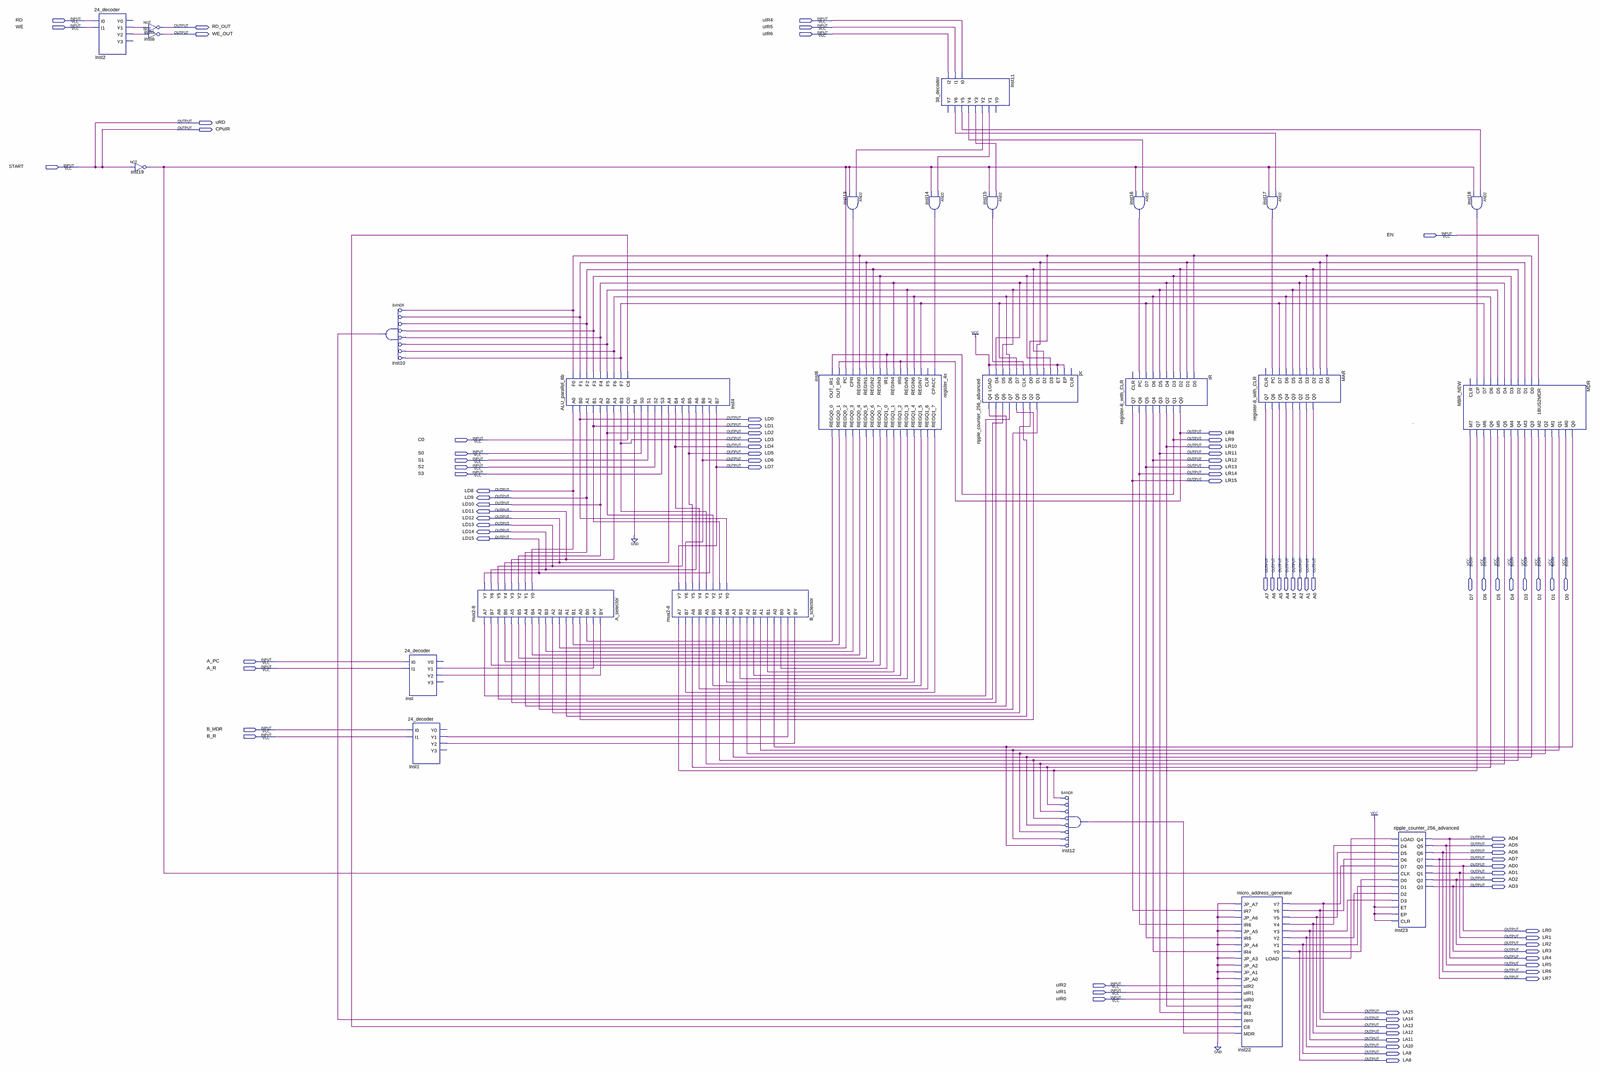
[diagram p0: schematic sheet, whole]
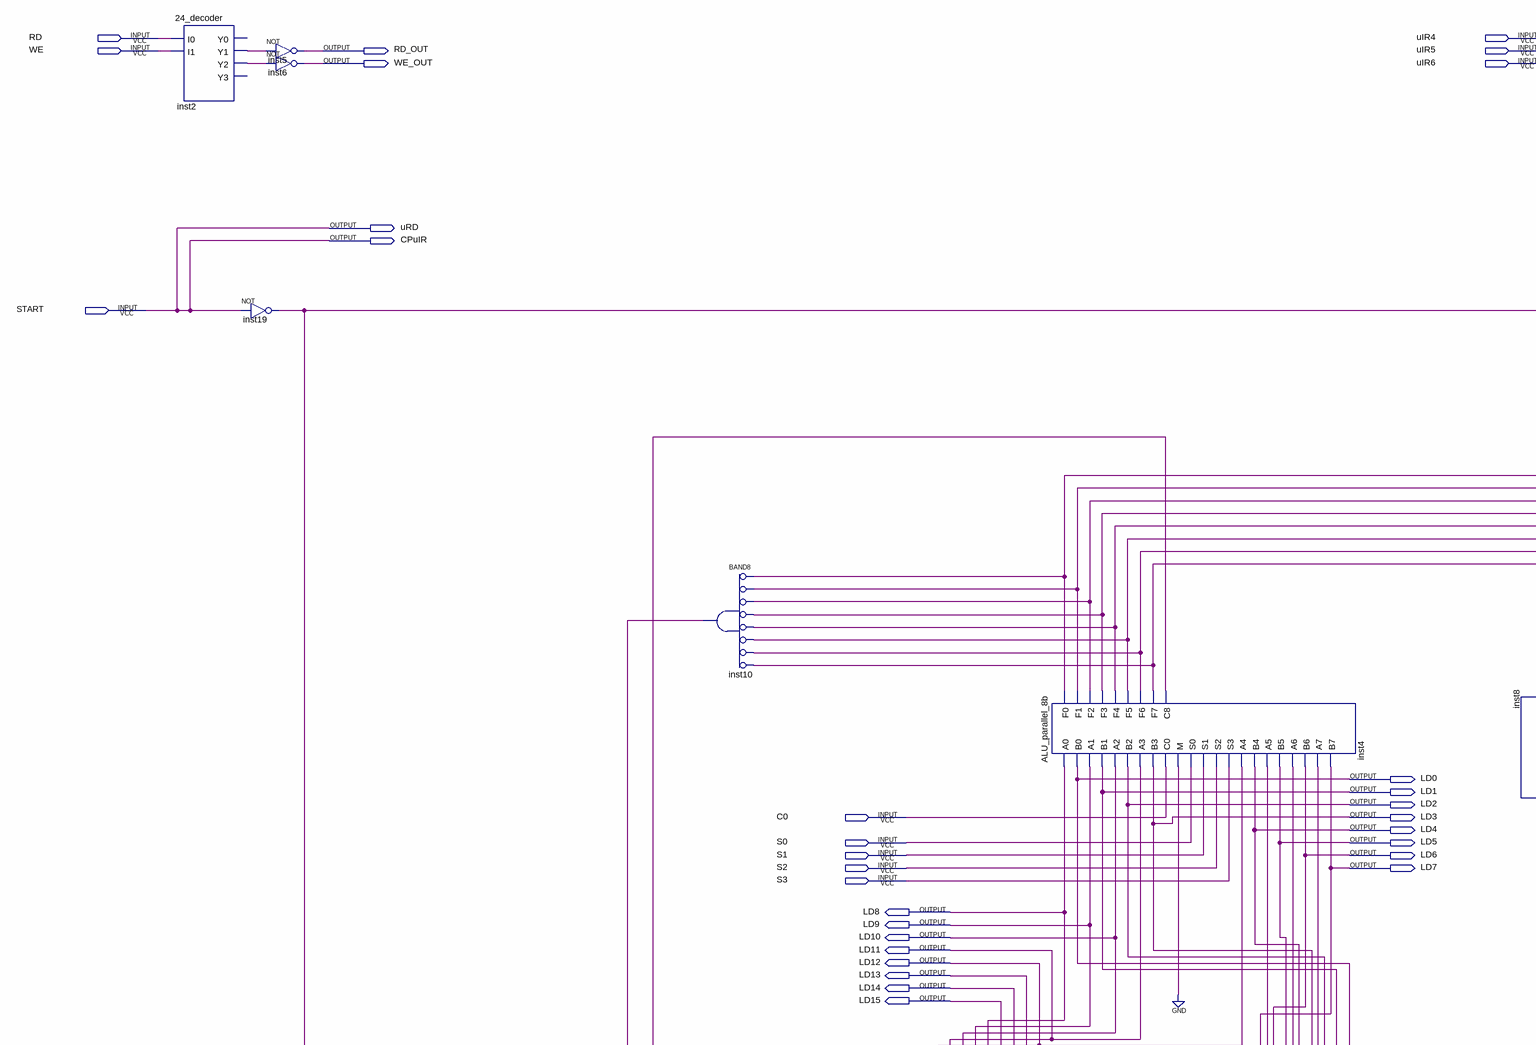
[diagram p1: schematic sheet, upper left part]
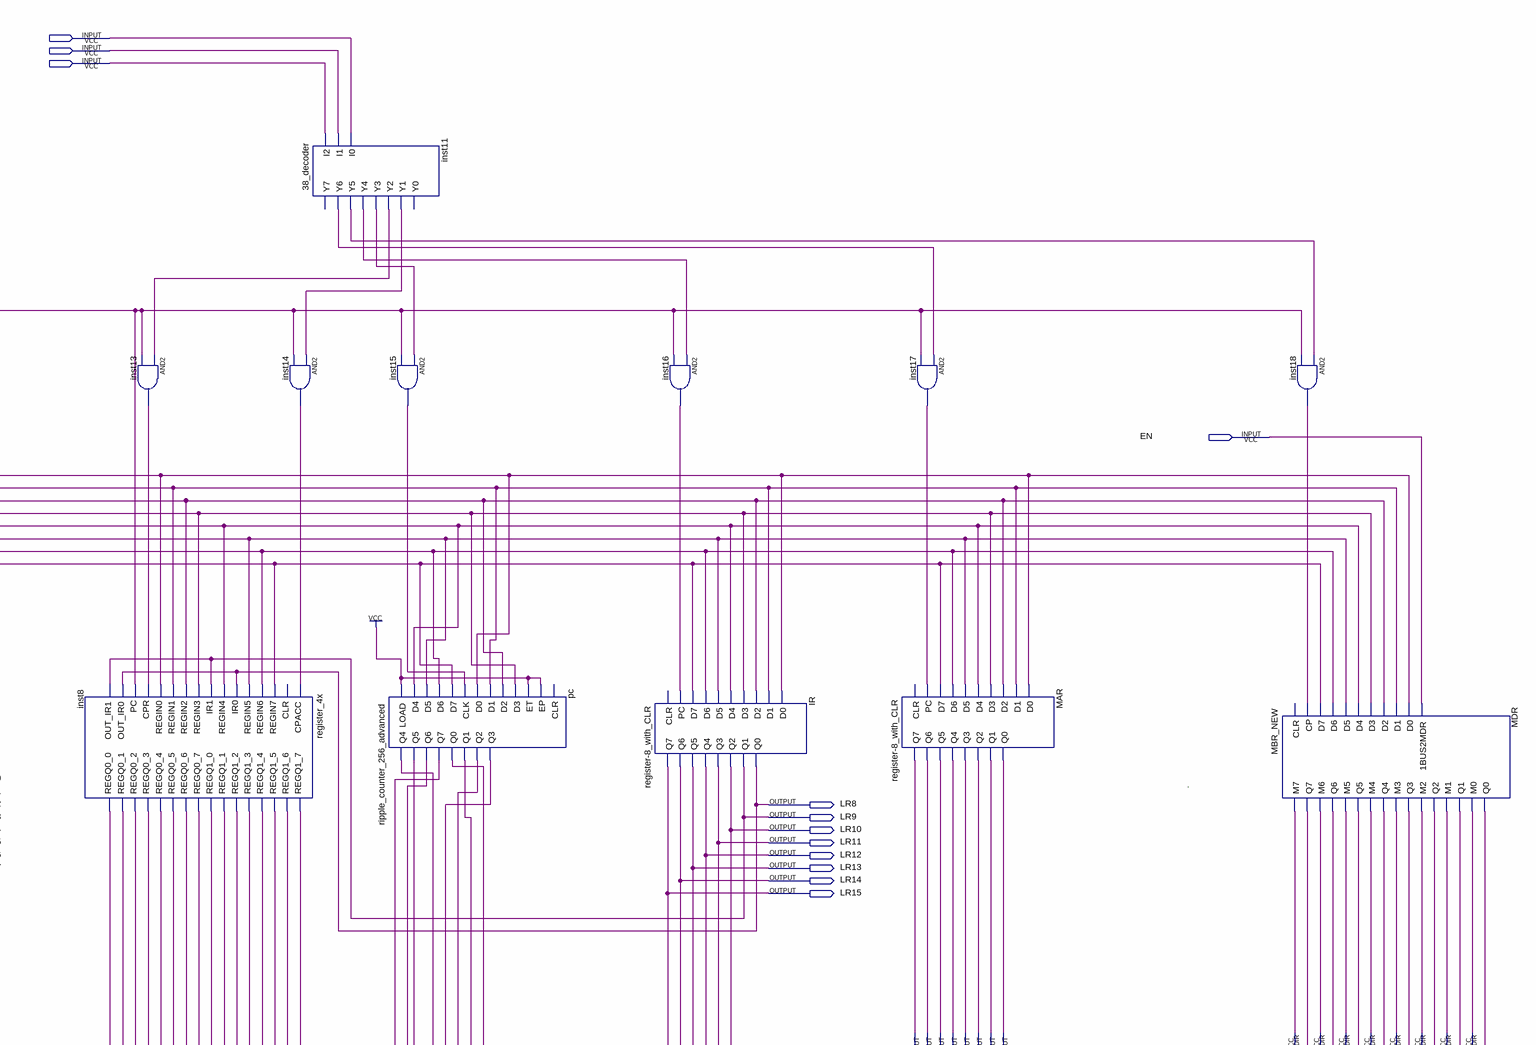
[diagram p2: schematic sheet, upper right part]
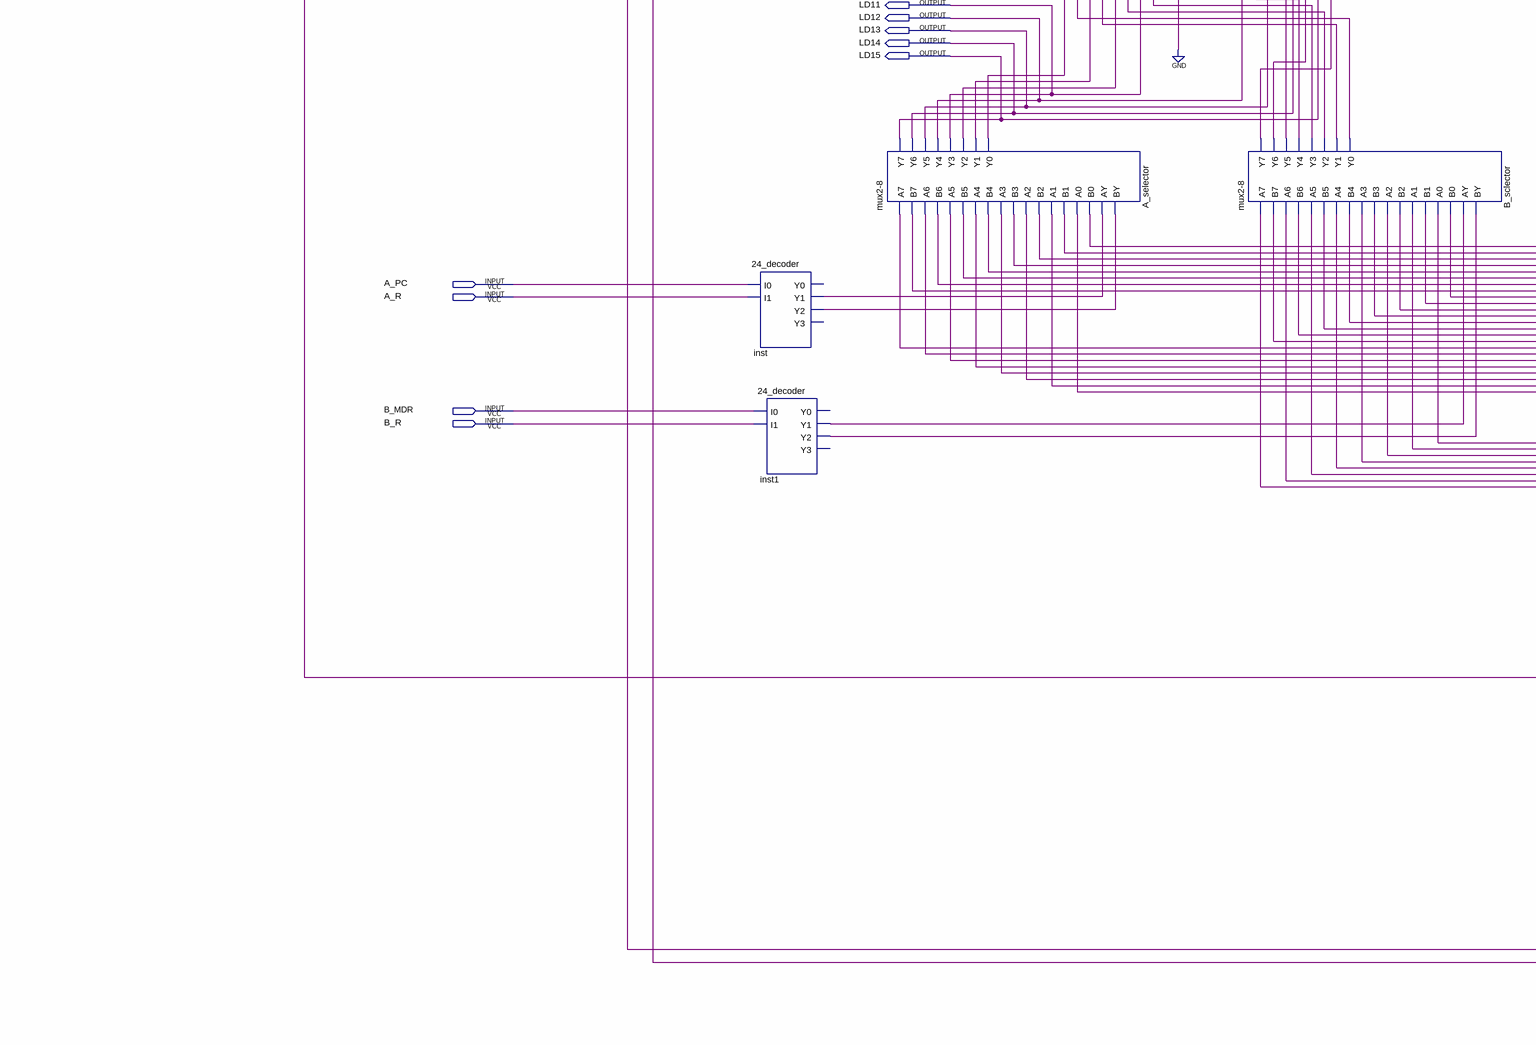
[diagram p3: schematic sheet, lower left part]
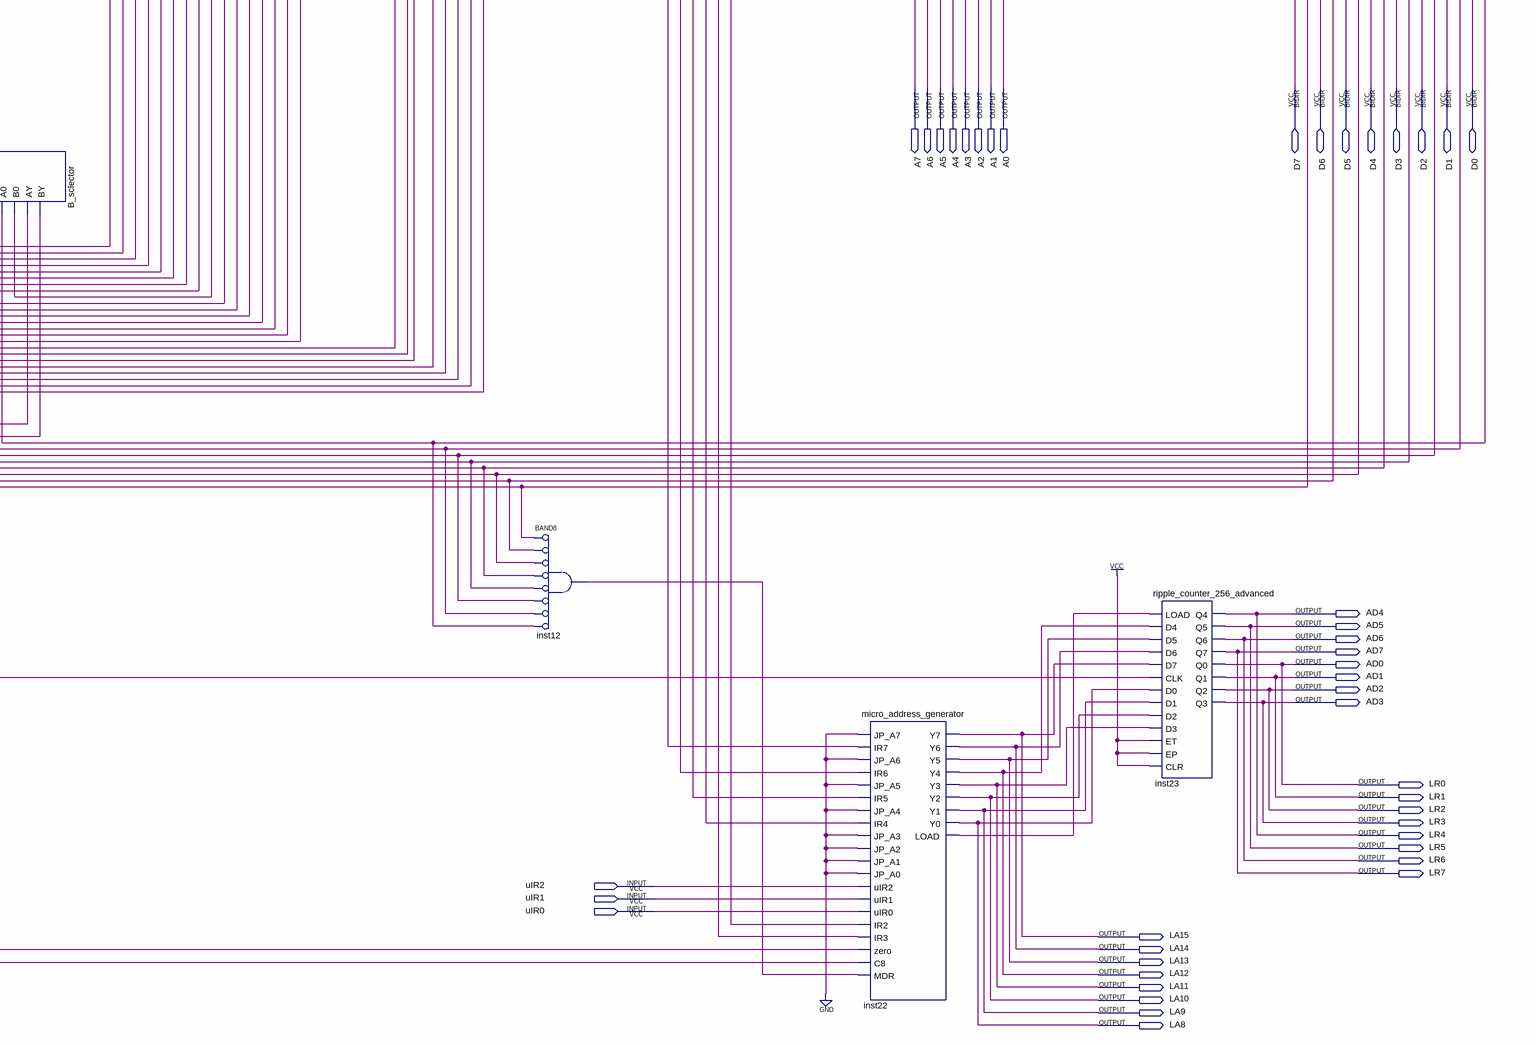
[diagram p4: schematic sheet, lower right part]
// Quartus schematic machine_v1.bdf as structural Verilog: 25 symbols, 87 pins
module machine_v1 (
  input  RD,
  input  uIR4,
  input  WE,
  input  uIR5,
  input  uIR6,
  input  START,
  input  EN,
  input  C0,
  input  S0,
  input  S1,
  input  S2,
  input  S3,
  input  A_PC,
  input  A_R,
  input  B_MDR,
  input  B_R,
  input  uIR2,
  input  uIR1,
  input  uIR0,
  inout  D7,
  inout  D6,
  inout  D5,
  inout  D4,
  inout  D3,
  inout  D2,
  inout  D1,
  inout  D0,
  output RD_OUT,
  output WE_OUT,
  output uRD,
  output CPuIR,
  output LD0,
  output LD1,
  output LD2,
  output LR8,
  output LD3,
  output LR9,
  output LD4,
  output LR10,
  output LD5,
  output LR11,
  output LD6,
  output LR12,
  output LD7,
  output LR13,
  output LR14,
  output LR15,
  output LD8,
  output LD9,
  output LD10,
  output LD11,
  output LD12,
  output LD13,
  output LD14,
  output LD15,
  output A7,
  output A6,
  output A5,
  output A4,
  output A3,
  output A2,
  output A1,
  output A0,
  output AD4,
  output AD5,
  output AD6,
  output AD7,
  output AD0,
  output AD1,
  output AD2,
  output AD3,
  output LR0,
  output LR1,
  output LR2,
  output LR3,
  output LR4,
  output LR5,
  output LR6,
  output LR7,
  output LA15,
  output LA14,
  output LA13,
  output LA12,
  output LA11,
  output LA10,
  output LA9,
  output LA8
);

  wire inst1_y1, inst1_y2, inst2_y1, inst2_y2, inst4_c8, inst4_f0, inst4_f1, inst4_f2, inst4_f3, inst4_f4,
       inst4_f5, inst4_f6, inst4_f7, inst8_regq0_0, inst8_regq0_1, inst8_regq0_2, inst8_regq0_3,
       inst8_regq0_4, inst8_regq0_5, inst8_regq0_6, inst8_regq0_7, inst8_regq1_0, inst8_regq1_1,
       inst8_regq1_2, inst8_regq1_3, inst8_regq1_4, inst8_regq1_5, inst8_regq1_6, inst8_regq1_7, inst10_out,
       inst11_y1, inst11_y2, inst11_y3, inst11_y4, inst11_y5, inst11_y6, inst12_out, inst13_out, inst14_out,
       inst15_out, inst16_out, inst17_out, inst18_out, inst19_out, inst22_load, inst_y1, inst_y2, MDR_q0,
       MDR_q1, MDR_q2, MDR_q3, MDR_q4, MDR_q5, MDR_q6, MDR_q7, pc_q0, pc_q1, pc_q2, pc_q3, pc_q4, pc_q5,
       pc_q6, pc_q7;

  \24_decoder  inst2 (.I0(RD), .I1(WE), .Y1(inst2_y1), .Y2(inst2_y2));  // open: Y0, Y3
  not inst19 (inst19_out, START);
  not inst5 (RD_OUT, inst2_y1);
  not inst6 (WE_OUT, inst2_y2);
  and inst10 (inst10_out, ~inst4_f0, ~inst4_f1, ~inst4_f2, ~inst4_f3, ~inst4_f4, ~inst4_f5, ~inst4_f6, ~inst4_f7);  // BAND8
  \24_decoder  inst (.I0(A_PC), .I1(A_R), .Y1(inst_y1), .Y2(inst_y2));  // open: Y0, Y3
  \24_decoder  inst1 (.I0(B_MDR), .I1(B_R), .Y1(inst1_y1), .Y2(inst1_y2));  // open: Y0, Y3
  \mux2-8  A_selector (
    .A7(pc_q7), .B7(inst8_regq0_7), .A6(pc_q6), .B6(inst8_regq0_6), .A5(pc_q5), .B5(inst8_regq0_5),
    .A4(pc_q4), .B4(inst8_regq0_4), .A3(pc_q3), .B3(inst8_regq0_3), .A2(pc_q2), .B2(inst8_regq0_2),
    .A1(pc_q1), .B1(inst8_regq0_1), .A0(pc_q0), .B0(inst8_regq0_0), .AY(inst_y1), .BY(inst_y2), .Y7(LD15),
    .Y6(LD14), .Y5(LD13), .Y4(LD12), .Y3(LD11), .Y2(LD10), .Y1(LD9), .Y0(LD8));
  ALU_parallel_8b inst4 (
    .A0(LD8), .B0(LD0), .A1(LD9), .B1(LD1), .A2(LD10), .B2(LD2), .A3(LD11), .B3(LD3), .C0(C0), .M(1'b0),
    .S0(S0), .S1(S1), .S2(S2), .S3(S3), .A4(LD12), .B4(LD4), .A5(LD13), .B5(LD5), .A6(LD14), .B6(LD6),
    .A7(LD15), .B7(LD7), .F0(inst4_f0), .F1(inst4_f1), .F2(inst4_f2), .F3(inst4_f3), .F4(inst4_f4),
    .F5(inst4_f5), .F6(inst4_f6), .F7(inst4_f7), .C8(inst4_c8));
  \mux2-8  B_sclector (
    .A7(MDR_q7), .B7(inst8_regq1_7), .A6(MDR_q6), .B6(inst8_regq1_6), .A5(MDR_q5), .B5(inst8_regq1_5),
    .A4(MDR_q4), .B4(inst8_regq1_4), .A3(MDR_q3), .B3(inst8_regq1_3), .A2(MDR_q2), .B2(inst8_regq1_2),
    .A1(MDR_q1), .B1(inst8_regq1_1), .A0(MDR_q0), .B0(inst8_regq1_0), .AY(inst1_y1), .BY(inst1_y2), .Y7(LD7),
    .Y6(LD6), .Y5(LD5), .Y4(LD4), .Y3(LD3), .Y2(LD2), .Y1(LD1), .Y0(LD0));
  register_4x inst8 (
    .CPACC(inst14_out), .REGIN7(inst4_f7), .REGIN6(inst4_f6), .REGIN5(inst4_f5), .IR0(LR8),
    .REGIN4(inst4_f4), .IR1(LR9), .REGIN3(inst4_f3), .REGIN2(inst4_f2), .REGIN1(inst4_f1), .REGIN0(inst4_f0),
    .CPR(inst13_out), .PC(inst19_out), .OUT_IR0(LR8), .OUT_IR1(LR9), .REGQ1_7(inst8_regq1_7),
    .REGQ1_6(inst8_regq1_6), .REGQ1_5(inst8_regq1_5), .REGQ1_4(inst8_regq1_4), .REGQ1_3(inst8_regq1_3),
    .REGQ1_2(inst8_regq1_2), .REGQ1_1(inst8_regq1_1), .REGQ1_0(inst8_regq1_0), .REGQ0_7(inst8_regq0_7),
    .REGQ0_6(inst8_regq0_6), .REGQ0_5(inst8_regq0_5), .REGQ0_4(inst8_regq0_4), .REGQ0_3(inst8_regq0_3),
    .REGQ0_2(inst8_regq0_2), .REGQ0_1(inst8_regq0_1), .REGQ0_0(inst8_regq0_0));  // open: CLR
  and inst13 (inst13_out, inst11_y2, inst19_out);
  \38_decoder  inst11 (
    .I2(uIR6), .I1(uIR5), .I0(uIR4), .Y6(inst11_y6), .Y5(inst11_y5), .Y4(inst11_y4), .Y3(inst11_y3),
    .Y2(inst11_y2), .Y1(inst11_y1));  // open: Y7, Y0
  and inst14 (inst14_out, inst11_y1, inst19_out);
  ripple_counter_256_advanced pc (
    .LOAD(1'b1), .D4(inst4_f4), .D5(inst4_f5), .D6(inst4_f6), .D7(inst4_f7), .CLK(inst15_out), .D0(inst4_f0),
    .D1(inst4_f1), .D2(inst4_f2), .D3(inst4_f3), .ET(1'b1), .EP(1'b1), .Q4(pc_q4), .Q5(pc_q5), .Q6(pc_q6),
    .Q7(pc_q7), .Q0(pc_q0), .Q1(pc_q1), .Q2(pc_q2), .Q3(pc_q3));  // open: CLR
  and inst15 (inst15_out, inst11_y3, inst19_out);
  and inst12 (inst12_out, ~MDR_q7, ~MDR_q6, ~MDR_q5, ~MDR_q4, ~MDR_q3, ~MDR_q2, ~MDR_q1, ~MDR_q0);  // BAND8
  and inst16 (inst16_out, inst11_y4, inst19_out);
  \register-8_with_CLR  IR (
    .PC(inst16_out), .D7(inst4_f7), .D6(inst4_f6), .D5(inst4_f5), .D4(inst4_f4), .D3(inst4_f3),
    .D2(inst4_f2), .D1(inst4_f1), .D0(inst4_f0), .Q7(LR15), .Q6(LR14), .Q5(LR13), .Q4(LR12), .Q3(LR11),
    .Q2(LR10), .Q1(LR9), .Q0(LR8));  // open: CLR
  micro_address_generator inst22 (
    .JP_A7(1'b0), .IR7(LR15), .JP_A6(1'b0), .IR6(LR14), .JP_A5(1'b0), .IR5(LR13), .JP_A4(1'b0), .IR4(LR12),
    .JP_A3(1'b0), .JP_A2(1'b0), .JP_A1(1'b0), .JP_A0(1'b0), .uIR2(uIR2), .uIR1(uIR1), .uIR0(uIR0),
    .IR2(LR10), .IR3(LR11), .zero(inst10_out), .C8(inst4_c8), .MDR(inst12_out), .Y7(LA15), .Y6(LA14),
    .Y5(LA13), .Y4(LA12), .Y3(LA11), .Y2(LA10), .Y1(LA9), .Y0(LA8), .LOAD(inst22_load));
  and inst17 (inst17_out, inst11_y6, inst19_out);
  \register-8_with_CLR  MAR (
    .PC(inst17_out), .D7(inst4_f7), .D6(inst4_f6), .D5(inst4_f5), .D4(inst4_f4), .D3(inst4_f3),
    .D2(inst4_f2), .D1(inst4_f1), .D0(inst4_f0), .Q7(A7), .Q6(A6), .Q5(A5), .Q4(A4), .Q3(A3), .Q2(A2),
    .Q1(A1), .Q0(A0));  // open: CLR
  ripple_counter_256_advanced inst23 (
    .LOAD(inst22_load), .D4(LA12), .D5(LA13), .D6(LA14), .D7(LA15), .CLK(inst19_out), .D0(LA8), .D1(LA9),
    .D2(LA10), .D3(LA11), .ET(1'b1), .EP(1'b1), .CLR(1'b1), .Q4(AD4), .Q5(AD5), .Q6(AD6), .Q7(AD7), .Q0(AD0),
    .Q1(AD1), .Q2(AD2), .Q3(AD3));
  and inst18 (inst18_out, inst11_y5, inst19_out);
  MBR_NEW MDR (
    .CP(inst18_out), .D7(inst4_f7), .D6(inst4_f6), .D5(inst4_f5), .D4(inst4_f4), .D3(inst4_f3),
    .D2(inst4_f2), .D1(inst4_f1), .D0(inst4_f0), .\1BUS2MDR (EN), .Q7(MDR_q7), .Q6(MDR_q6), .Q5(MDR_q5),
    .Q4(MDR_q4), .Q3(MDR_q3), .Q2(MDR_q2), .Q1(MDR_q1), .Q0(MDR_q0), .M7(D7), .M6(D6), .M5(D5), .M4(D4),
    .M3(D3), .M2(D2), .M1(D1), .M0(D0));  // open: CLR

  assign CPuIR = START;
  assign LR0 = AD0;
  assign LR1 = AD1;
  assign LR2 = AD2;
  assign LR3 = AD3;
  assign LR4 = AD4;
  assign LR5 = AD5;
  assign LR6 = AD6;
  assign LR7 = AD7;
  assign uRD = START;

  // Notes on the sheet:
  //   .
endmodule
